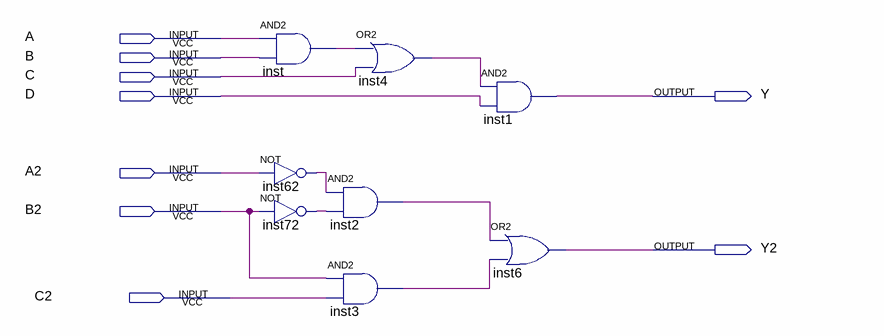
[diagram p0: schematic sheet]
// Quartus schematic temporizador.bdf as structural Verilog: 8 symbols, 9 pins
module temporizador (
  input  A,
  input  B,
  input  C,
  input  D,
  input  A2,
  input  B2,
  input  C2,
  output Y,
  output Y2
);

  wire inst2_out, inst3_out, inst4_out, inst62_out, inst72_out, inst_out;

  and inst (inst_out, A, B);
  not inst62 (inst62_out, A2);
  not inst72 (inst72_out, B2);
  or inst4 (inst4_out, inst_out, C);
  and inst2 (inst2_out, inst62_out, inst72_out);
  and inst3 (inst3_out, B2, C2);
  and inst1 (Y, inst4_out, D);
  or inst6 (Y2, inst2_out, inst3_out);
endmodule
